# EAGLE design metaPixel3V2 (EAGLE 7.4.1)
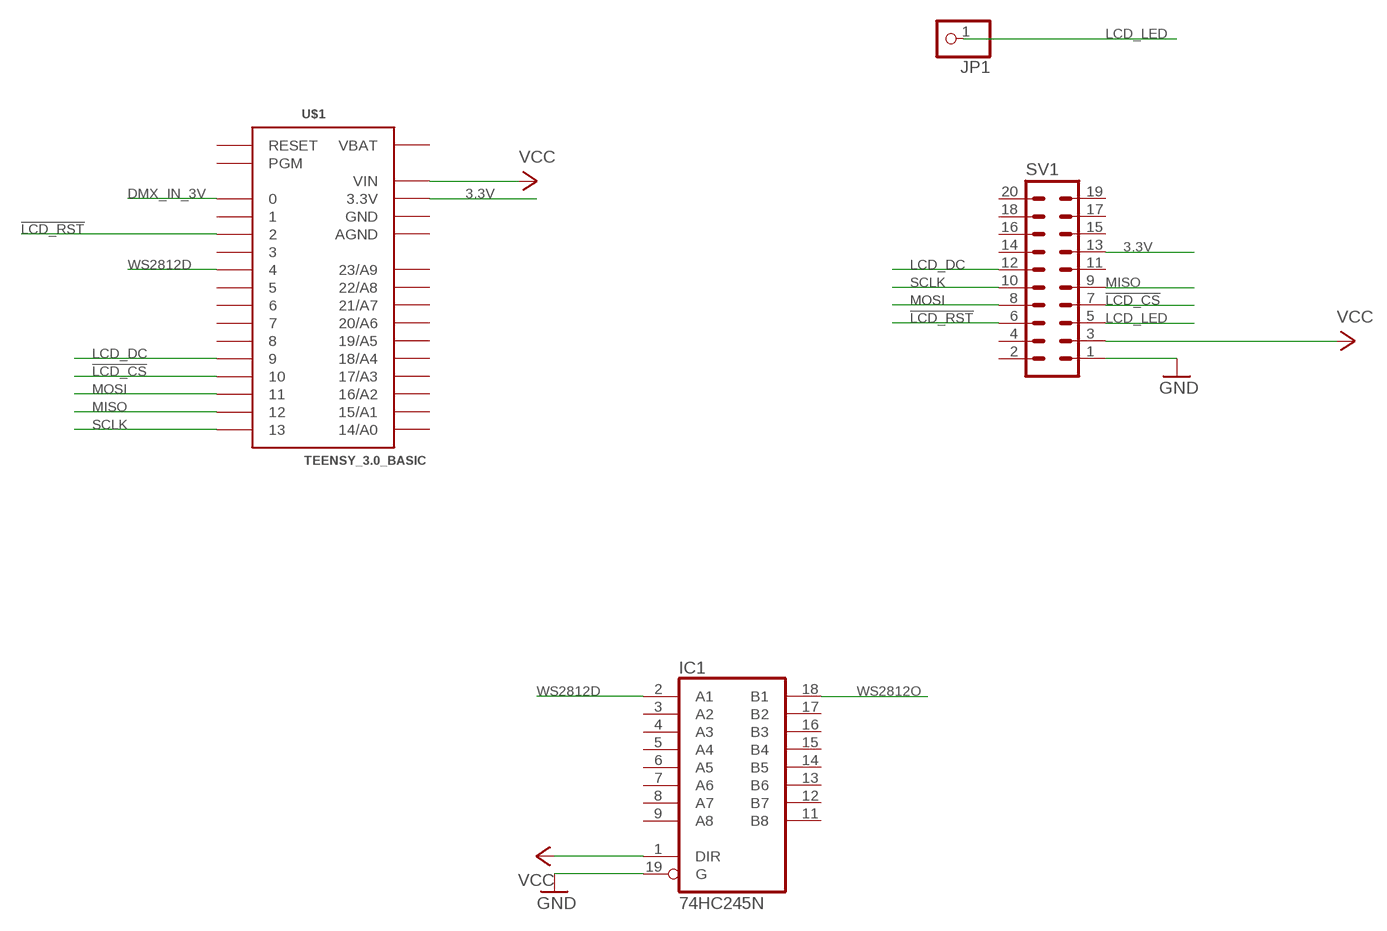
[diagram p0: schematic, sheet 1]

## Parts
IC1  74HC245N  [DIL20]
JP1  PINHD-1X1  [1X01]
SV1  ML20  [ML20]
U$1  TEENSY_3.0_BASIC  [TEENSY_3.0_BASIC]

## Nets
3.3V: SV1.13 U$1.3.3V U$1.3.3V1(3.3V)
!LCD_CS: SV1.7 U$1.10
!LCD_RST: SV1.6 U$1.2
DMX_IN_3V: U$1.0
GND: IC1.19(G) SV1.1
LCD_DC: SV1.12 U$1.9
LCD_LED: JP1.1 SV1.5
MISO: SV1.9 U$1.12
MOSI: SV1.8 U$1.11
SCLK: SV1.10 U$1.13
VCC: IC1.1(DIR) SV1.3 U$1.VIN
WS2812D: IC1.2(A1) U$1.4
WS2812O: IC1.18(B1)
Unconnected: IC1.3(A2) IC1.4(A3) IC1.5(A4) IC1.6(A5) IC1.7(A6) IC1.8(A7) IC1.9(A8) IC1.11(B8) IC1.12(B7) IC1.13(B6) IC1.14(B5) IC1.15(B4) IC1.16(B3) IC1.17(B2) SV1.2 SV1.4 SV1.11 SV1.14 SV1.15 SV1.16 SV1.17 SV1.18 SV1.19 SV1.20 U$1.1 U$1.3 U$1.5 U$1.6 U$1.7 U$1.8 U$1.14/A0 U$1.15/A1 U$1.16/A2 U$1.17/A3 U$1.18/A4 U$1.19/A5 U$1.20/A6 U$1.21/A7 U$1.22/A8 U$1.23/A9 U$1.PGM U$1.RESET

## Power pins joined to a net without a drawn wire
AGND: U$1.AGND
GND: IC1.10(GND) U$1.GND U$1.GND1(GND)
VBAT: U$1.VBAT
VCC: IC1.20(VCC)

## Library data of the parts
IC1 = 74xx-eu:74*245: Octal BUS TRANSCEIVER, 3-state
JP1 = pinhead:PINHD-1X1: PIN HEADER
SV1 = con-ml:ML20: HARTING; OC_FARNELL: unknown; OC_NEWARK: unknown
U$1 = Teensy3.0:TEENSY_3.0_BASIC: Basic Teensy 3.0 with none of the 'inner' pins enabled. See '+4', 'AllAnalogPins", and 'AllPins' packages for additional pin holes, as needed.

## Board
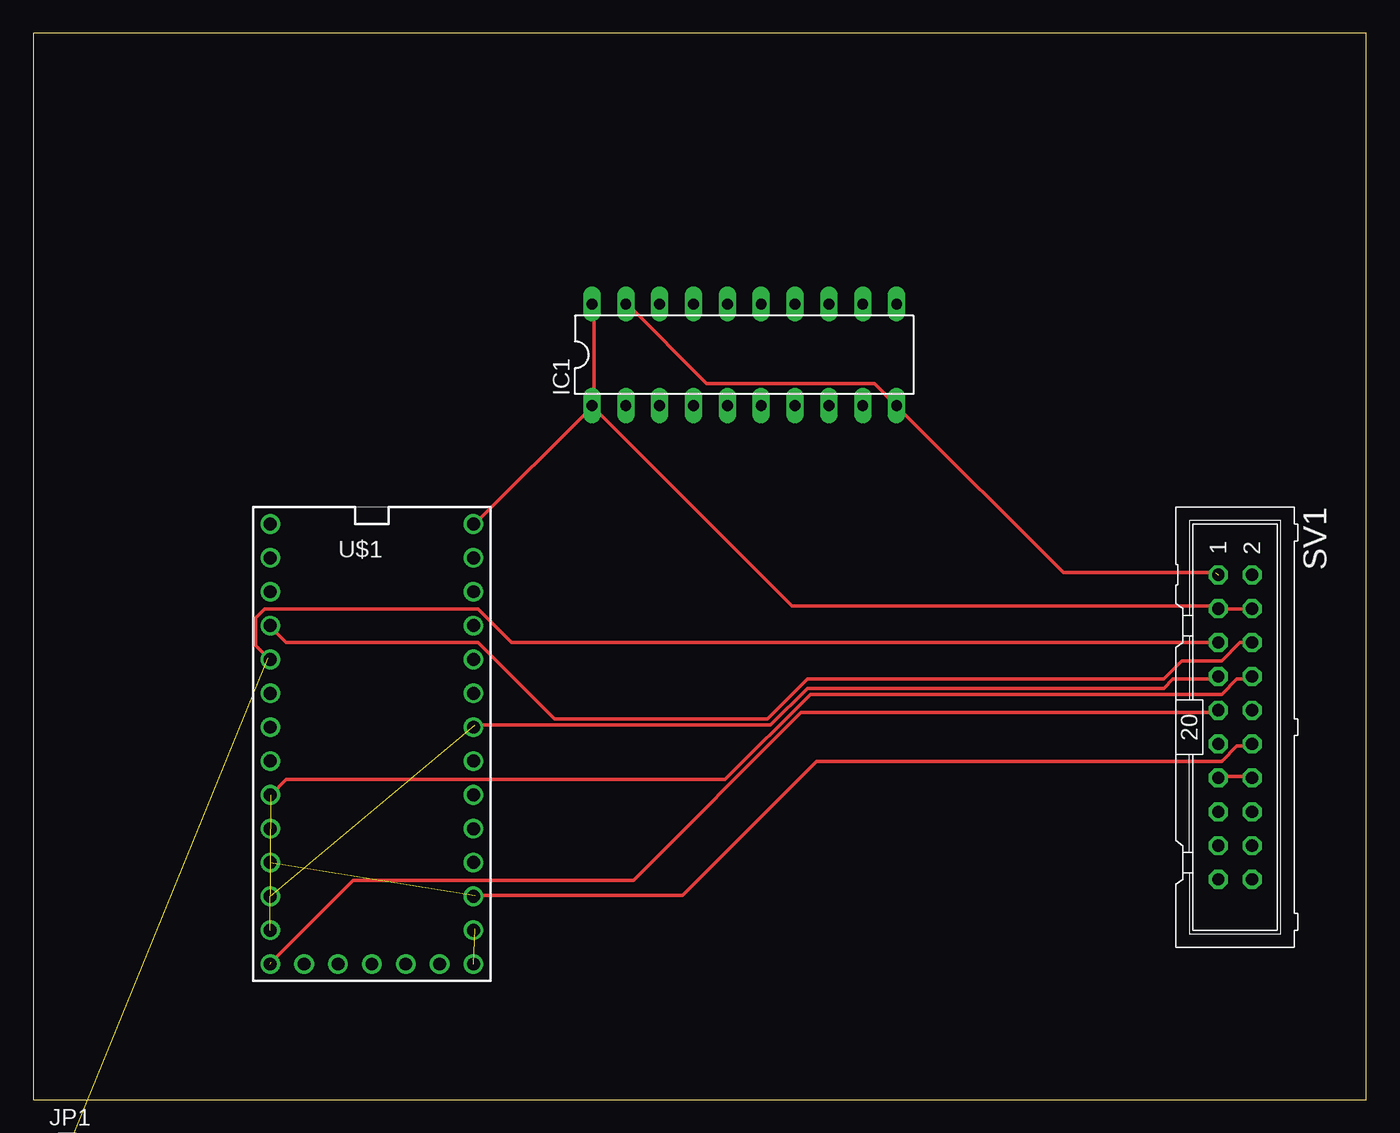
[diagram p1: board, top side]
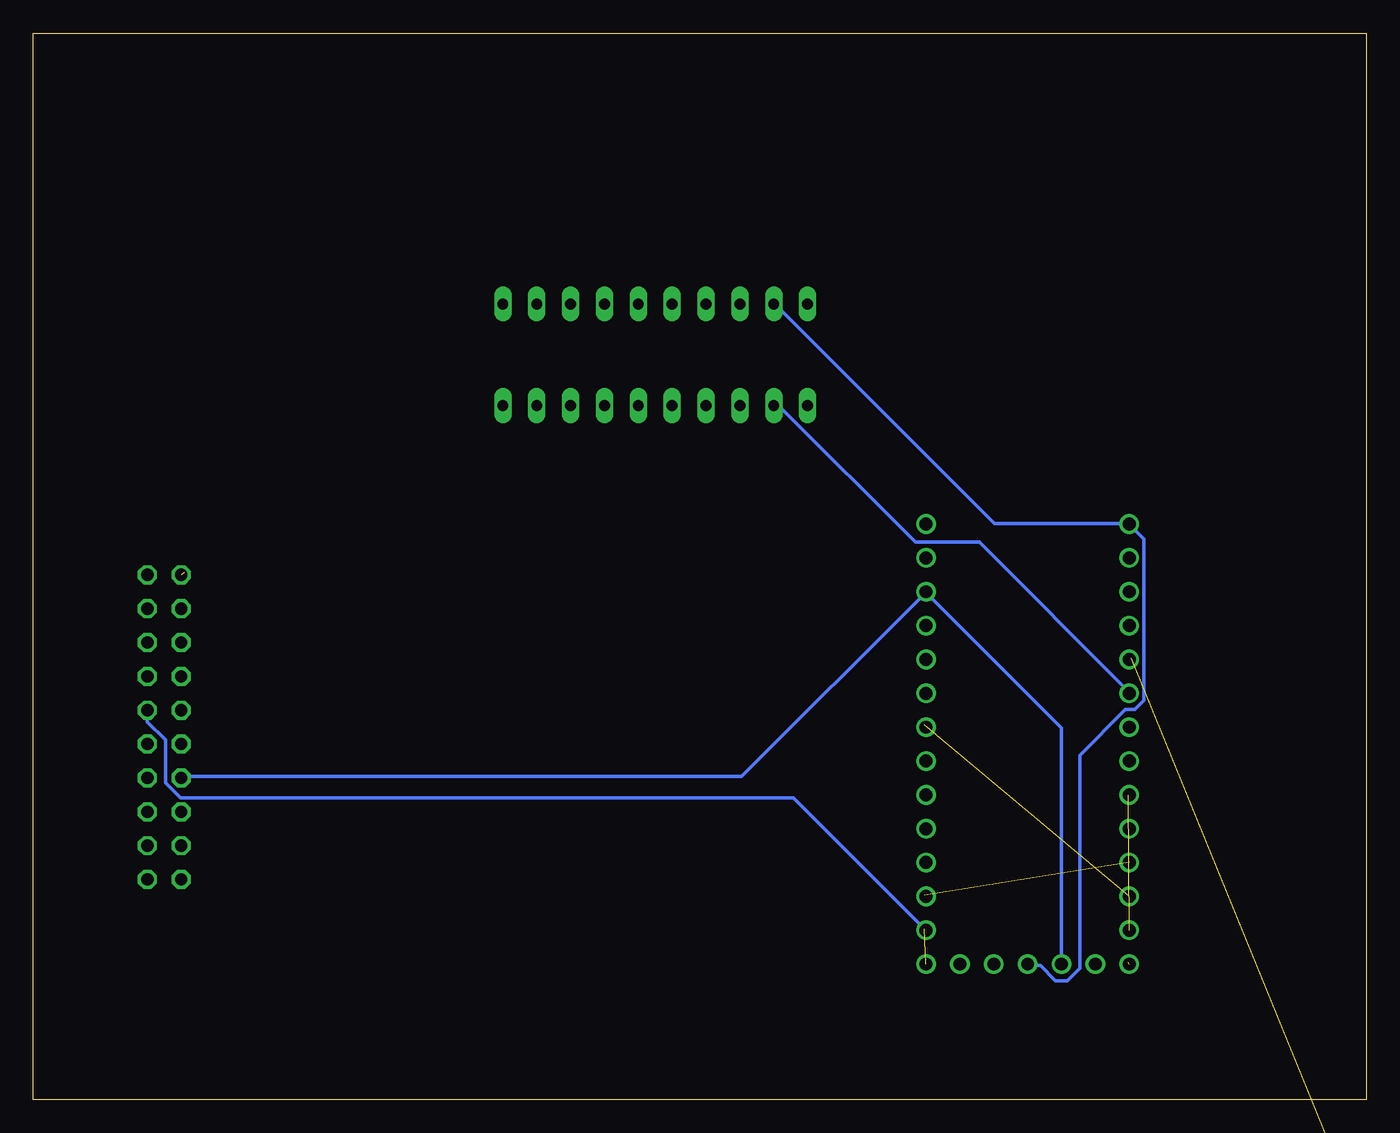
[diagram p2: board, bottom side, seen from below]

Size 100 x 80 mm. Coordinates in mm from the lower left corner, seen from the top.
Outline: 0,0 100,0 100,80 0,80 0,0
Copper layers (1*16): Top 0.035mm / dielectric 1.5mm / Bottom 0.035mm
Design rules "default": minimum track width 10mil, minimum drill 24mil, track to track 8mil, track to pad 8mil, pad to pad 8mil, via to via 8mil, smd to smd 8mil, copper to edge 40mil, drill to drill 8mil, minimum pad ring 10mil, minimum via ring 8mil, stop-mask expansion 4mil, vias tented up to drill 0mil, thermal gap 10mil

### Footprints (pad centres in the part's own frame; a part is rotated, then mirrored left to right if it is on the bottom)
DIL20 = drill 0.813 long: 1 -11.43,-3.81; 2 -8.89,-3.81; 3 -6.35,-3.81; 4 -3.81,-3.81; 5 -1.27,-3.81; 6 1.27,-3.81; 7 3.81,-3.81; 8 6.35,-3.81; 9 8.89,-3.81; 10 11.43,-3.81; 11 11.43,3.81; 12 8.89,3.81; 13 6.35,3.81; 14 3.81,3.81; 15 1.27,3.81; 16 -1.27,3.81; 17 -3.81,3.81; 18 -6.35,3.81; 19 -8.89,3.81; 20 -11.43,3.81
1X01 = drill 1.016 octagon: 1 0,0
ML20 = drill 0.914 octagon: 1 -11.43,-1.27; 2 -11.43,1.27; 3 -8.89,-1.27; 4 -8.89,1.27; 5 -6.35,-1.27; 6 -6.35,1.27; 7 -3.81,-1.27; 8 -3.81,1.27; 9 -1.27,-1.27; 10 -1.27,1.27; 11 1.27,-1.27; 12 1.27,1.27; 13 3.81,-1.27; 14 3.81,1.27; 15 6.35,-1.27; 16 6.35,1.27; 17 8.89,-1.27; 18 8.89,1.27; 19 11.43,-1.27; 20 11.43,1.27
TEENSY_3.0_BASIC = drill 0.965: 0 -7.62,13.97; 1 -7.62,11.43; 2 -7.62,8.89; 3 -7.62,6.35; 3.3V 7.62,11.43; 3.3V1 -2.54,-16.51; 4 -7.62,3.81; 5 -7.62,1.27; 6 -7.62,-1.27; 7 -7.62,-3.81; 8 -7.62,-6.35; 9 -7.62,-8.89; 10 -7.62,-11.43; 11 -7.62,-13.97; 12 -7.62,-16.51; 13 7.62,-16.51; 14/A0 7.62,-13.97; 15/A1 7.62,-11.43; 16/A2 7.62,-8.89; 17/A3 7.62,-6.35; 18/A4 7.62,-3.81; 19/A5 7.62,-1.27; 20/A6 7.62,1.27; 21/A7 7.62,3.81; 22/A8 7.62,6.35; 23/A9 7.62,8.89; AGND 7.62,13.97; GND -7.62,16.51; GND1 0,-16.51; PGM 2.54,-16.51; RESET 5.08,-16.51; VBAT -5.08,-16.51; VIN 7.62,16.51

### Placement (x,y rotation side)
IC1  53.34,55.88 0 top
JP1  2.54,-3.81 0 top  (outside the outline)
SV1  90.17,27.94 270 top
U$1  25.4,26.67 0 top

### Tracks (layer width: path | path; a pad name or v marks a point on that pad's centre or on a via)
3.3V
  Top 0.254: 91.44,24.23 88.92,24.23 SV1.13
  Bottom 0.254: U$1.3.3V1 22.86,27.89 32.92,37.95 U$1.3.3V 33.15,37.95 46.86,24.23 88.7,24.23 SV1.13
!LCD_CS  (1 unrouted)
  Top 0.254: 33.15,28.12 55.32,28.12 58.06,30.86 84.81,30.86 85.5,31.55 88.7,31.55 SV1.7
!LCD_RST
  Top 0.254: SV1.6 90.53,34.29 89.15,32.92 86.18,32.92 84.81,31.55 58.06,31.55 55.09,28.57 39.09,28.57 33.38,34.29 18.97,34.29 17.83,35.43 U$1.2
GND  (1 unrouted)
  Top 0.254: IC1.19 44.58,59.66 50.52,53.72 63.09,53.72 64.69,52.12 IC1.10 64.92,51.89 77.27,39.55 88.7,39.55
  Bottom 0.254: IC1.19 44.35,59.66 27.89,43.2 17.83,43.2 U$1.GND 17.6,42.98 16.69,42.06 16.69,29.95 17.37,29.26 18.06,29.26 21.49,25.83 21.49,9.83 22.4,8.91 23.32,8.91 24.46,10.06 25.38,10.06 U$1.GND1
LCD_DC  (1 unrouted)
  Top 0.254: 33.15,15.32 48.69,15.32 58.75,25.38 89.15,25.38 90.3,26.52 91.44,26.52 SV1.12
LCD_LED  (1 unrouted)
  Top 0.254: SV1.5 35.89,34.29 33.38,36.8 17.37,36.8 16.69,36.12 16.69,34.06 17.6,33.15
MISO  (1 unrouted)
  Top 0.254: 17.83,10.29 24,16.46 45.03,16.46 57.61,29.03 88.7,29.03 SV1.9
MOSI  (1 unrouted)
  Top 0.254: 17.83,22.86 18.97,24 51.89,24 58.29,30.4 89.15,30.4 90.3,31.55 91.44,31.55 SV1.8
SCLK  (1 unrouted)
  Bottom 0.254: SV1.10 91.44,28.35 90.07,26.98 90.07,23.77 88.92,22.63 42.98,22.63 33.15,12.8
VCC
  Top 0.254: 91.44,36.8 88.92,36.8 SV1.3 88.7,37.03 56.92,37.03 42.06,51.89 IC1.1 | IC1.1 42.06,52.12 42.06,59.66 IC1.20 | U$1.VIN 33.15,43.2 41.83,51.89 IC1.1
WS2812D
  Bottom 0.254: IC1.2 44.35,51.89 43.89,51.89 33.83,41.83 29.03,41.83 17.83,30.63 U$1.4